# Altium schematic sheet Voltage Regulator.SchDoc
size A; SheetNumber: 4; SheetTotal: 8
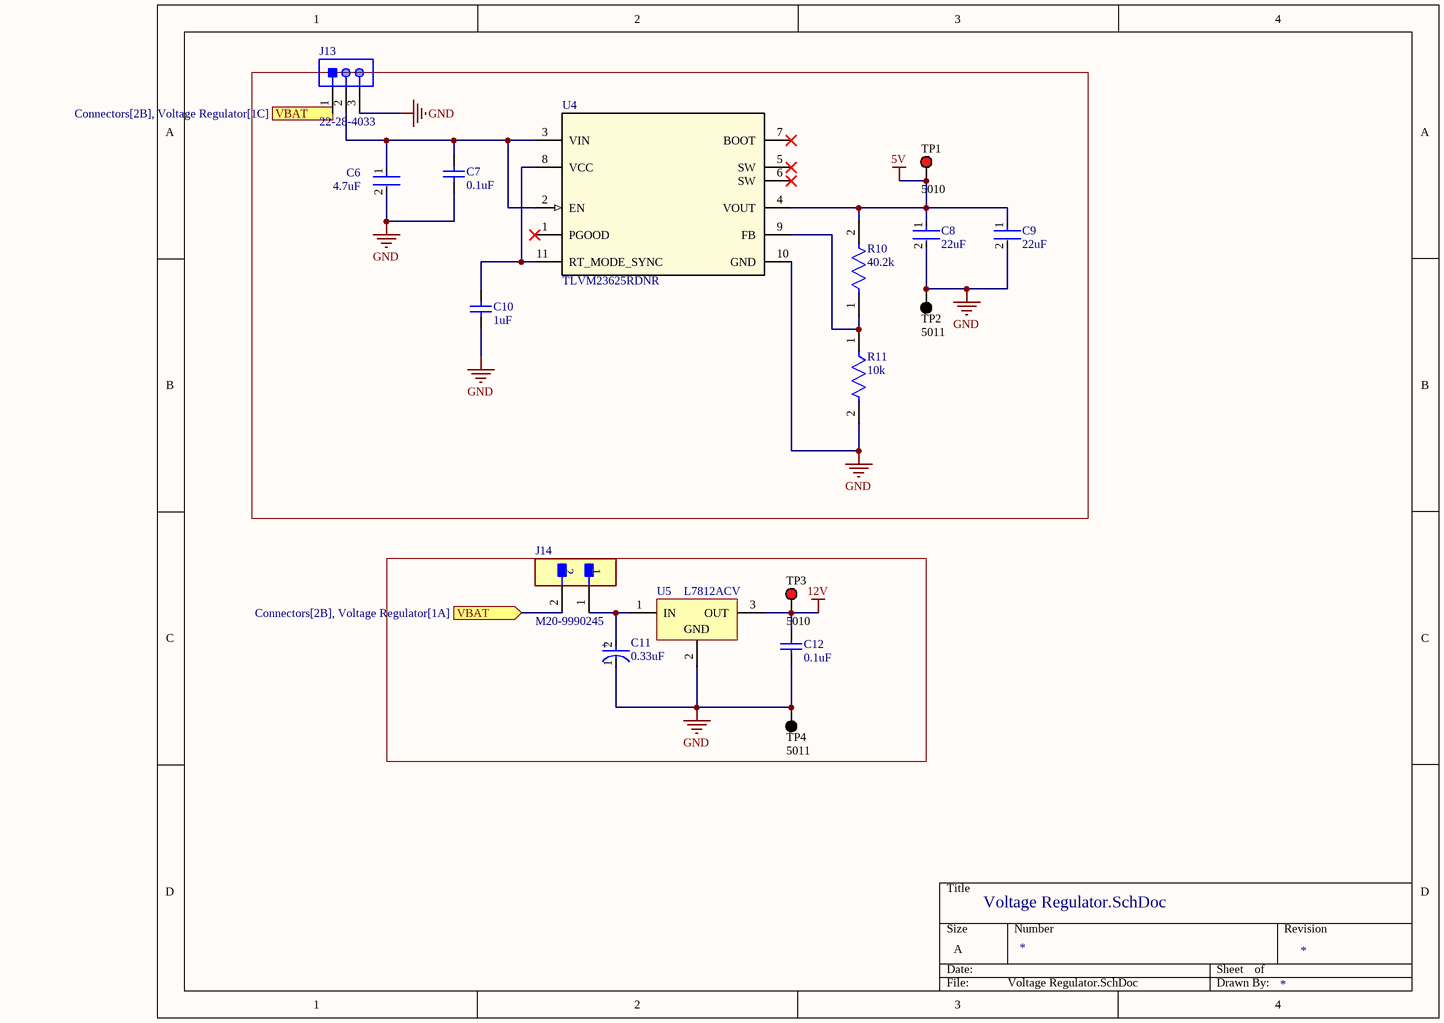
[diagram p0: Voltage Regulator.SchDoc]

## Parts
C6  4.7uF  [FP-C1210X475K5RACTU-MFG]
C7  0.1uF  [CAPC1608X90X35ML10T15]
C8  22uF  [FP-1210-L_3_3_0_4-W_2_5_0-MFG]
C9  22uF  [FP-1210-L_3_3_0_4-W_2_5_0-MFG]
C10  1uF  [CAPC2013X145X50LL20T25]
C11  0.33uF  [FP-TAJS-MFG]
C12  0.1uF  [CAPC1608X90X35ML10T15]
J13  22-28-4033  [MOLX-22-28-4033_V]
J14  M20-9990245  [FP-M20-9990245-MFG]
R10  40.2k  [FP-CRCW0603-e3-IPC_B]
R11  10k  [FP-MCT0603-IPC_C]
TP1  5010  [KSTN-5010_V]
TP2  5011  [KSTN-5011_V]
TP3  5010  [KSTN-5010_V]
TP4  5011  [KSTN-5011_V]
U4  TLVM23625RDNR  [RDN0011A-MFG]
U5  L7812ACV  [TO220]

## Ports
VBAT (in, see Connectors[2B], Voltage Regulator[1A]), VBAT (in, see Connectors[2B], Voltage Regulator[1C])

## Nets
5V: C8.1 C9.1 R10.2 TP1.1 U4.4(VOUT)
12V: C12.2 TP3.1 U5.3(OUT)
GND: C6.2 C7.1 C8.2 C9.2 C10.1 C11.1(C) C12.1 J13.3 R11.2 TP2.1 TP4.1 U4.10(GND) U5.2(GND)
VBAT: J13.1 J14.2 ; port VBAT
NetC6_1: C6.1 C7.2 J13.2 U4.2(EN) U4.3(VIN)
NetC10_2: C10.2 U4.8(VCC) U4.11(RT_MODE_SYNC)
NetC11_2: C11.2(A) J14.1 U5.1(IN)
NetR10_1: R10.1 R11.1 U4.9(FB)

Not connected (* = marked no-connect by the designer): U4 1(PGOOD)* 5(SW)* 6(SW)* 7(BOOT)*

## Notes on the sheet
- (in symbol CMP-04424-000233-1) +

## Library data of the parts
C6 = CMP-2000-06022-2: CAP CER 4.7UF 50V X7R 1210; Tolerance: 10%; Dielectric Material: Ceramic; Dissipation Factor: 2.5%; Voltage Rating: 50V; Case Code (Imperial): 1210; Case Code (Metric): 3225; Length: 3.3mm; Thickness: 0.11inch; Series: FT-CAP; Radiation Hardening: No; Min Operating Temperature: -55°C; Dielectric: X7R; RoHS Compliant: Yes; REACH SVHC: No SVHC; Mount: Surface Mount; Construction: Flat; Termination: SMD/SMT; Packaging: Tape and Reel; Voltage Rating (DC): 50V; Capacitance: 4.7uF; Depth: 2.5mm; Package Quantity: 1000; Width: 2.5mm; Features: Soft Termination; Number of Pins: 2; Voltage: 50V; Case/Package: 1210; Height: 2.5mm; Max Operating Temperature: 125°C
C7 C12 = CMP-2100-03643-1: Chip Capacitor, 0.1 uF, +/- 10%, 50 V, -55 to 125 degC, 0603 (1608 Metric), RoHS, Tape and Reel; Manufacturer: Murata; Dielectric Material: Ceramic; Voltage Rating: 50V; Capacitance: 100nF; Dielectric: X7R; Insulation Resistance: 10GR; Case Code (Metric): 1608; Lead Free: LeadFree; Depth: 0.8mm; Number of Pins: 2; Radiation Hardening: No; Case/Package: 0603; Manufacturer URL: http://www.murata.com/; Packaging: TapeandReel; Length: 1.6mm; Contact Plating: Tin; Datasheet URL: http://psearch.en.murata.com/capacitor/product/GRM188R71H104KA93%23.pdf; Tolerance: 10%; Case Code (Imperial): 0603; Min Operating Temperature: -55degC; RoHSCompliant: true; Voltage: 50V; Termination: SMD/SMT; Mount: SurfaceMount; Material: Ceramic; Package Quantity: 1; Height: 0.8mm; Thickness: 0.035inch; REACH SVHC: NoSVHC; Max Operating Temperature: 125degC; Width: 0.8mm; Package Reference: 0603; Voltage Rating (DC): 50V; Datasheet Version: 42675.0; Package Description: 2-Pin Surface Mount Device, Body 1.6 x 0.8 mm
C8 C9 = CMP-2000-05483-2: General Purpose Ceramic Capacitor, 1210, 22uF, 10%, X5R, 15%, 16V; Tolerance: 10%; Width: 0.098inch; Length: 3.2mm; Min Operating Temperature: -55°C; Capacitance: 22uF; Case/Package: 1210; Termination: SMD/SMT; Voltage: 16V; Number of Pins: 2; Thickness: 0.11inch; Height: 2.79mm; Weight: 0.000564oz; Case Code (Imperial): 1210; Contact Plating: Tin; Lead Free: Lead Free; RoHS Compliant: Yes; Packaging: Tape and Reel; Package Quantity: 1; Construction: Flat; Series: -; REACH SVHC: No SVHC; Case Code (Metric): 3225; Size: 2.79mm; Radiation Hardening: No; Voltage Rating: 16V; Depth: 2.5mm; Mount: Surface Mount; Voltage Rating (DC): 16V; Dielectric: X5R; Max Operating Temperature: 85°C
C10 = CMP-1036-04746-2: Manufacturer: Kemet; Part Number: C0805C105K4PACTU
C11 = CMP-04424-000233-1: 330nF 35V  ±10% 15Ω 1206  SMD Tantalum Capacitor; Leakage Current: 500nA; Polarity: Polar; ESR (Equivalent Series Resistance): 15R; Dissipation Factor: 4%; Max Operating Temperature: 125°C; Height: 1.2mm; Depth: 1.6mm; RoHS Compliant: Yes; Voltage Rating: 35V; Case Code (Imperial): 1206; REACH SVHC: No SVHC; Min Operating Temperature: -55°C; Termination: SMD/SMT; Width: 1.6mm; Radiation Hardening: No; Lead Free: Lead Free; Case Code (Metric): 3216; Height - Seated (Max): 0.047inch; Lead Pitch: 1.1mm; Case/Package: 1206; Series: TAJ; Package Quantity: 2500; Features: General Purpose; Length: 3.2mm; Packaging: Tape and Reel; Construction: Flat; Tolerance: 10%; Mount: Surface Mount; Capacitance: 330nF; Dielectric Material: Tantalum; Weight: 0.000571oz; Number of Pins: 2; Voltage Rating (DC): 35V
J13 = CMP-1676-00001-5: Male Header, Pitch 2.54 mm, 1 x 3 Position, Height 8.38 mm, Tail Length 3.18 mm, RoHS, Bulk; Manufacturer: Molex; Rows: 1; Voltage Rating: 250 V; Current Rating: 4 A; Min Operating Temperature: 0 degC; Lead Pitch: 0.1 inch; Packaging: Bulk; Contact Finish: Gold; RoHSCompliant: true; Contact Material: Brass; PackageReference: 22-28-4033; REACH SVHC: Unknown; PackageDescription: Male Header, Pitch 2.54 mm, 1 x 3 Position, Height 8.38 mm, Tail Length 3.18 mm; ComponentLink2URL: http://www.molex.com/pdm_docs/sd/022284033_sd.pdf; Height: 8.38 mm; Mounting Technology: Through Hole; ComponentLink1Description: Manufacturer URL; Length: 7.62 mm; Mount: Through Hole; DatasheetVersion: Rev. G, 01/2012; Max Operating Temperature: 75 degC; ComponentLink2Description: Datasheet; Colour: Black; Pins: 3; Contact Plating: Gold; Package Quantity: 1; ComponentLink1URL: http://www.molex.com/
J14 = CMP-15831-000105-1: CONN HEADER VERT 2POS 2.54MM; Working Voltage: 750V; Gender: Male; Number of Poles: 2; Current Rating: 3A; Mated Stacking Heights: 16.54mm; Contact Resistance: 25mR; Connector Type: Male Pin; Insulation Resistance: 10GR; Mating Cycles: 300; Voltage: 50V; Flammability Rating: UL94 V-0; Pitch: 2.54mm; Series: M20; Number of Contacts: 2; Height: 0.12inch; Min Operating Temperature: -40°C; Contact Finish - Mating: GOLD; Number of Positions: 2; Number of Rows: 1; Packaging: Bulk; Package Quantity: 1000; Voltage Rating (AC): 750V; Current: 3A; Mount: Through Hole; Case/Package: SIL; Orientation: Straight; Contact Shape: Square; Weight: 0.25lb; Radiation Hardening: No; Fastening Type: Pull; Length: 5.08mm; Depth: 2.54mm; Contact Mating Length: 0.24inch; Housing Material: Nylon; Reach SVHC Compliant: Yes; Insulation Material: Nylon; Color: Black; Width: 0.25inch; Insulation Color: Black; Contact Material: Brass; Contact Type: Male Pin; Termination: Solder; Max Operating Temperature: 105°C; Contact Plating: Gold; Housing Color: Black; Max Current Rating: 3A; Lead Pitch: 2.54mm
R10 = CMP-2000-03336-2: RES Thick Film, 40.2kΩ, 1%, 0.1W, 100ppm/°C, 0603; Voltage Rating (DC): 75V; Power Rating: 100mW; Resistance: 40.2kR; Packaging: Tape and Reel; Radiation Hardening: No; Lead Free: Lead Free; Contact Plating: Tin; Weight: 7.1E-05oz; Voltage Rating: 75V; Temperature Coefficient: 100ppm/°C; Case Code (Imperial): 0603; Max Operating Temperature: 155°C; Width: 0.85mm; Package Quantity: 5000; Termination: SMD/SMT; Case/Package: 0603; Case Code (Metric): 1608; Depth: 0.85mm; Tolerance: 1%; Composition: Thick Film; Length: 1.55mm; Military Standard: Not; Height: 0.45mm; Min Operating Temperature: -55°C
R11 = CMP-02407-000418-1: RES SMD 100 OHM 1% 1/8W 0603; Voltage Rating: 75V; Power Rating: 100mW; Temperature Coefficient: 50ppm/°C; Max Power Dissipation: 125mW; Resistance: 10kR; Case/Package: 0603; Military Standard: Not; Min Operating Temperature: -55°C; Width: 0.8mm; Package Quantity: 1; Max Operating Temperature: 125°C; Tolerance: 1%; Depth: 0.85mm; Radiation Hardening: No; Mount: Surface Mount; Composition: Thin Film; Contact Plating: Tin; Lead Free: Lead Free; Case Code (Imperial): 0603; Number of Terminations: 2; Voltage Rating (DC): 75V; Length: 1.55mm; Packaging: Tape and Reel; Height: 0.022inch; Case Code (Metric): 1608
TP1 TP3 = CMP-1672-00002-4: Test Point, Red, Through Hole, RoHS, Bulk; Manufacturer: Keystone; Contact Material: Bronze; Mounting Technology: Through Hole; RoHSCompliant: true; Pins: 1; Package Quantity: 100; ComponentLink2Description: Datasheet; Height: 8.12 mm; ComponentLink1URL: http://www.keyelco.com/; DatasheetVersion: Rev. F, 12/2013; Mount: Through Hole; PackageReference: 5010; Contact Plating: Silver; Packaging: Bulk; Colour: Red; REACH SVHC: No SVHC; PackageDescription: 1-Pin Through Hole Device, Dia 3.17 mm; ComponentLink2URL: http://www.keyelco.com/product-pdf.cfm?p=1319; ComponentLink1Description: Manufacturer URL
TP2 TP4 = CMP-1672-00003-4: Test Point, Black, Through Hole, RoHS, Bulk; Manufacturer: Keystone; ComponentLink2URL: http://www.keyelco.com/product-pdf.cfm?p=1320; Colour: Black; Pins: 1; REACH SVHC: No SVHC; ComponentLink1URL: http://www.keyelco.com/; PackageReference: 5011; Contact Plating: Silver; Package Quantity: 100; Packaging: Bulk; RoHSCompliant: true; Height: 8.12 mm; PackageDescription: 1-Pin Through Hole Device, Dia 3.17 mm; Mount: Through Hole; Mounting Technology: Through Hole; DatasheetVersion: Rev. F, 12/2013; ComponentLink1Description: Manufacturer URL; Contact Material: Bronze; ComponentLink2Description: Datasheet
U4 = TLVM23625RDNR: No Description Available; Mfr_Name: Texas Instruments; TYPE: TYPE; RefDes: RefDes
U5 = CMP-0244-00451-1: Positive Voltage Regulator, 12V, 3-Pin TO-220; PackageDescription: TO, Thru-Hole, Vertical, Heatsink Mounted; 3 In-Line Leads; Pitch 2.54 mm; ComponentLink3URL: http://www.st.com/internet/com/TECHNICAL_RESOURCES/TECHNICAL_LITERATURE/PACKAGE_INFORMATION/CD00004649.pdf; ComponentLink3Description: Package Specification; DatasheetVersion: 16/11/2011; ComponentLink1Description: Manufacturer URL; PackageVersion: ver3.0; PackageReference: TO220; ComponentLink1URL: http://www.st.com; ComponentLink2Description: Datasheet; ComponentLink2URL: http://www.st.com/internet/com/TECHNICAL_RESOURCES/TECHNICAL_LITERATURE/DATASHEET/CD00000444.pdf